# EAGLE design GERI_Gadget (EAGLE 9.1.0)
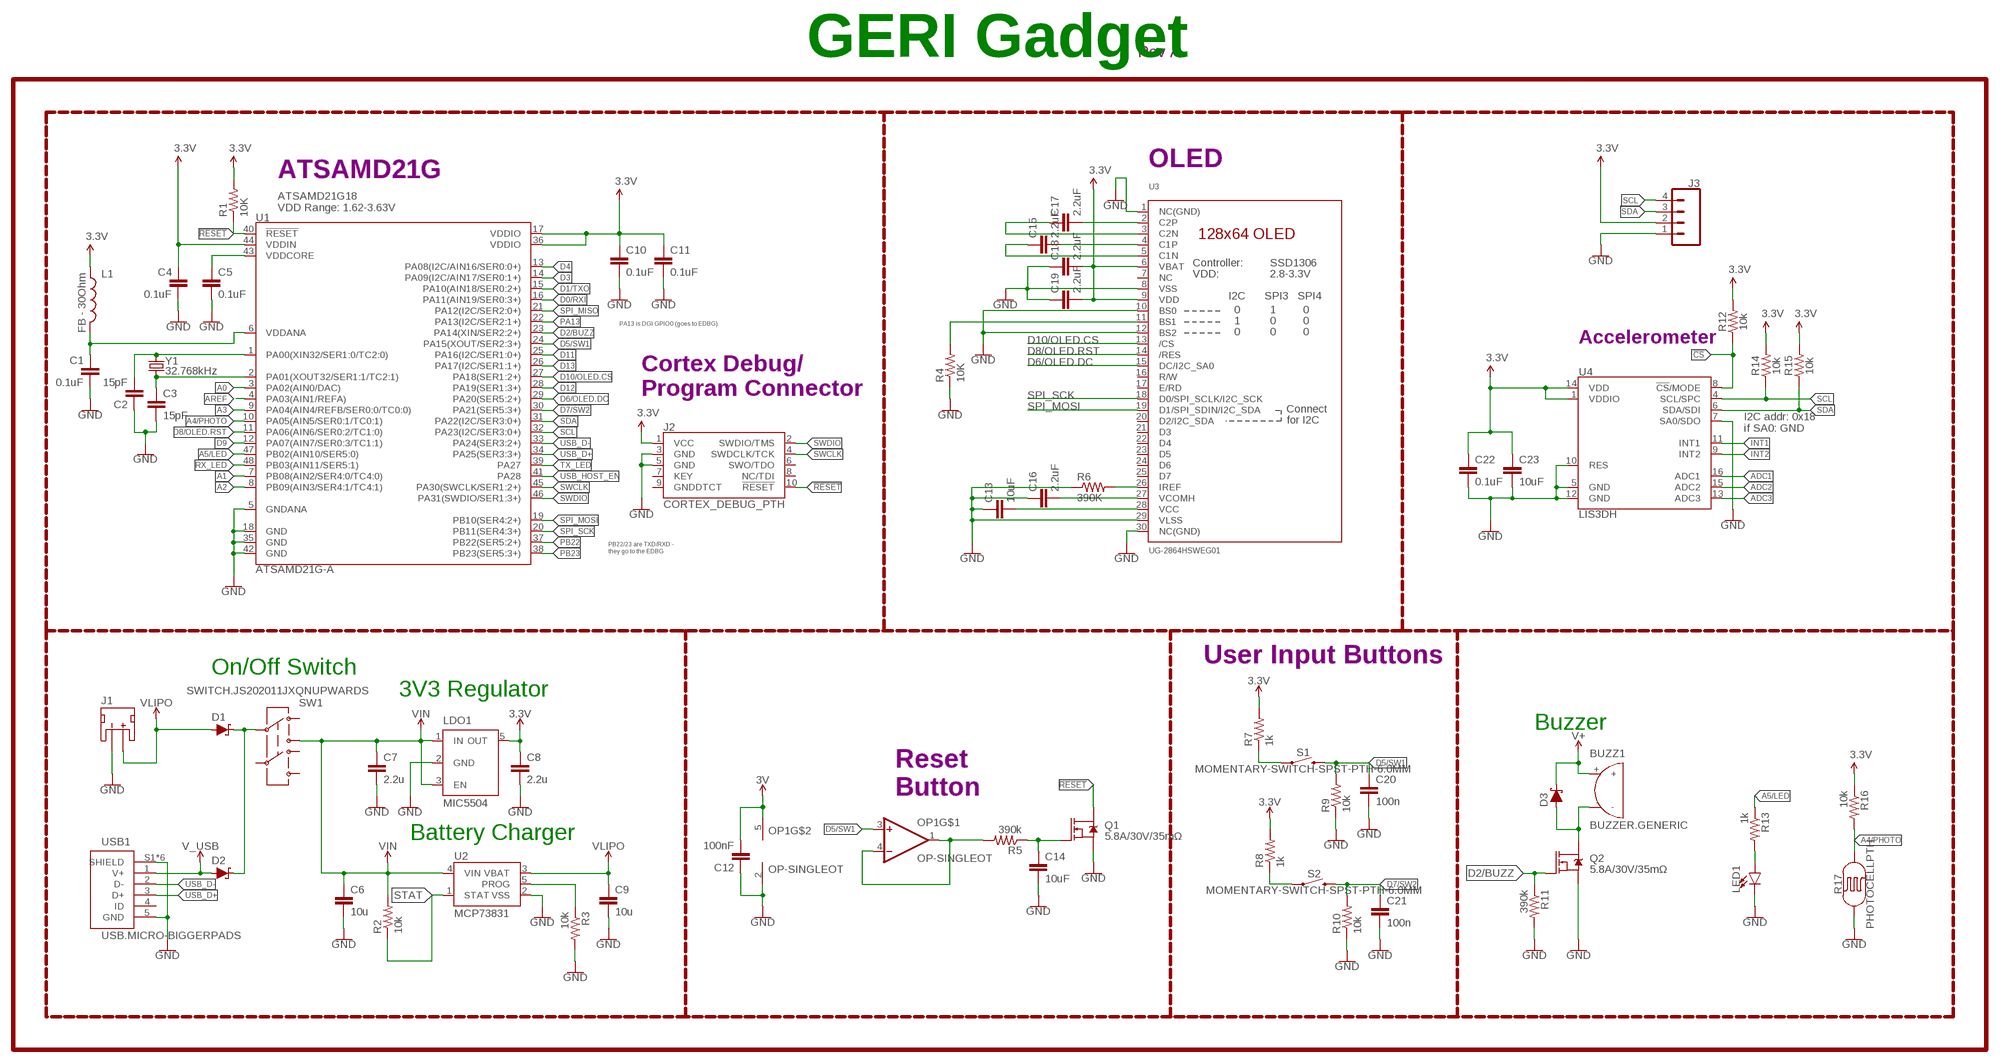
[diagram p0: schematic, sheet 1]

## Parts
BUZZ1  BUZZER.GENERIC  [PIEZO-1]
C1  0.1uF  CAPACITOR0402  [C0402]
C2  15pF  CAPACITOR0402  [C0402]
C3  15pF  CAPACITOR0402  [C0402]
C4  0.1uF  CAPACITOR0402  [C0402]
C5  0.1uF  CAPACITOR0402  [C0402]
C6  10u  CAPACITOR0603  [C0603]
C7  2.2u  CAPACITOR0603  [C0603]
C8  2.2u  CAPACITOR0603  [C0603]
C9  10u  CAPACITOR0603  [C0603]
C10  0.1uF  CAPACITOR0402  [C0402]
C11  0.1uF  CAPACITOR0402  [C0402]
C12  100nF  CAPACITOR0402  [C0402]
C13  10uF  CAPACITOR0603  [C0603]
C14  10uF  CAPACITOR0603  [C0603]
C15  2.2uF  CAPACITOR0603  [C0603]
C16  2.2uF  CAPACITOR0603  [C0603]
C17  2.2uF  CAPACITOR0603  [C0603]
C18  2.2uF  CAPACITOR0603  [C0603]
C19  2.2uF  CAPACITOR0603  [C0603]
C20  100n  CAPACITOR0402  [C0402]
C21  100n  CAPACITOR0402  [C0402]
C22  0.1uF  0.1UF-0402-16V-10%  [0402]
C23  10uF  10UF-0603-6.3V-20%  [0603]
D1  SCHOTTKY-USC  [USC]
D2  SCHOTTKY-USC  [USC]
D3  SCHOTTKY-USC  [USC]
J1  JST_2MM_MALE  [JST-2-SMD]
J2  CORTEX_DEBUG_PTH  [2X5-PTH-1.27MM]
J3  CONN_04  [1X04]
L1  FB - 30Ohm  INDUCTOR0603  [0603]
LDO1  MIC5504  [SOT23-5]
LED1  LED5MM  [LED_5MM]
OP1  OP-SINGLEOT  [SOT23-5]
Q1  5.8A/30V/35mΩ  NFET-AO3404A  [SOT23-3]
Q2  5.8A/30V/35mΩ  NFET-AO3404A  [SOT23-3]
R1  10K  RESISTOR0402-BIGGER  [R0402-BIGGER]
R2  10k  RESISTOR0402-BIGGER  [R0402-BIGGER]
R3  10k  RESISTOR0402-BIGGER  [R0402-BIGGER]
R4  10K  RESISTOR0402-BIGGER  [R0402-BIGGER]
R5  390k  RESISTOR0402-BIGGER  [R0402-BIGGER]
R6  390K  RESISTOR0402-BIGGER  [R0402-BIGGER]
R7  1k  RESISTOR0402-BIGGER  [R0402-BIGGER]
R8  1k  RESISTOR0402-BIGGER  [R0402-BIGGER]
R9  10k  RESISTOR0402-BIGGER  [R0402-BIGGER]
R10  10k  RESISTOR0402-BIGGER  [R0402-BIGGER]
R11  390k  RESISTOR0402-BIGGER  [R0402-BIGGER]
R12  10k  RESISTOR0402  [0402]
R13  1k  RESISTOR0402-BIGGER  [R0402-BIGGER]
R14  10k  RESISTOR0402  [0402]
R15  10k  RESISTOR0402  [0402]
R16  10k  RESISTOR0402-BIGGER  [R0402-BIGGER]
R17  PHOTOCELLPTH  [PHOTOCELL]
REV1  REVISION.A  [REV.A]
S1  MOMENTARY-SWITCH-SPST-PTH-6.0MM  [TACTILE_SWITCH_PTH_6.0MM]
S2  MOMENTARY-SWITCH-SPST-PTH-6.0MM  [TACTILE_SWITCH_PTH_6.0MM]
SW1  SWITCH.JS202011JXQNUPWARDS  [SWITCH.00]
U1  ATSAMD21G-A  [TQFP-48]
U2  MCP73831  [SOT23-5]
U3  UG-2864HSWEG01  DISP_OLED_UG-2864HSWEG01-NO-WRAPAROUND  [UG-2864HSWEG01_0.96IN_NO-WRAPAROUND]
U4  LIS3DH  [LGA-16-3X3]
USB1  USB.MICRO-BIGGERPADS  [USB-MICRO-01.BIGGERPADS]
Y1  32.768kHz  CRYSTAL3.2X1.5MM  [CRYSTAL-SMD-3.2X1.5MM]

## Nets
3.3V: C4.1 C8.1 C10.1 C11.1 C18.2 C19.2 C22.1 C23.1 J2.1(VCC) J3.2 L1.1 LDO1.5(OUT) R1.2 R7.2 R8.2 R12.2 R14.2 R15.2 R16.1 U1.17(VDDIO) U1.36(VDDIO) U1.44(VDDIN) U3.6(VBAT) U3.9(VDD) U4.1(VDDIO) U4.14(VDD)
3V: C12.2 OP1.5(V+)
!CS: R12.1 U4.8(!CS!/MODE)
!RESET: J2.10(!RESET) Q1.3(D) R1.1 U1.40(!RESET!)
A0: U1.3(PA02(AIN0/DAC))
A1: U1.7(PB08(AIN2/SER4:0/TC4:0))
A2: U1.8(PB09(AIN3/SER4:1/TC4:1))
A3: U1.9(PA04(AIN4/REFB/SER0:0/TC0:0))
A4/PHOTO: R16.2 R17.2 U1.10(PA05(AIN5/SER0:1/TC0:1))
A5/LED: R13.1 U1.47(PB02(AIN10/SER5:0))
ADC1: U4.16(ADC1)
ADC2: U4.15(ADC2)
ADC3: U4.13(ADC3)
AREF: U1.4(PA03(AIN1/REFA))
D0/RXI: U1.16(PA11(AIN19/SER0:3+))
D1/TXO: U1.15(PA10(AIN18/SER0:2+))
D2/BUZZ: Q2.1(G) R11.1 U1.23(PA14(XIN/SER2:2+))
D3: U1.14(PA09(I2C/AIN17/SER0:1+))
D4: U1.13(PA08(I2C/AIN16/SER0:0+))
D5/SW1: C20.1 OP1.3(+IN) R9.2 S1.3 U1.24(PA15(XOUT/SER2:3+))
D6/OLED.DC: U1.29(PA20(SER5:2+)) U3.15(DC/I2C_SA0)
D7/SW2: C21.1 R10.2 S2.3 U1.30(PA21(SER5:3+))
D8/OLED.RST: U1.11(PA06(AIN6/SER0:2/TC1:0)) U3.14(/RES)
D9: U1.12(PA07(AIN7/SER0:3/TC1:1))
D10/OLED.CS: U1.27(PA18(SER1:2+)) U3.13(/CS)
D11: U1.25(PA16(I2C/SER1:0+))
D12: U1.28(PA19(SER1:3+))
D13: U1.26(PA17(I2C/SER1:1+))
GND: C1.2 C2.1 C3.2 C4.2 C5.2 C6.2 C7.2 C8.2 C9.2 C10.2 C11.2 C12.1 C13.1 C14.2 C16.1 C18.1 C19.1 C20.2 C21.2 C22.2 C23.2 J1.1(-) J2.3(GND) J2.5(GND) J3.1 LDO1.2(GND) LED1.K(C) OP1.2(V-) Q1.2(S) Q2.2(S) R3.2 R4.1 R6.1 R9.1 R10.1 R11.2 R17.1 U1.5(GNDANA) U1.18(GND) U1.35(GND) U1.42(GND) U2.2(VSS) U3.1(NC(GND)) U3.8(VSS) U3.10(BS0) U3.12(BS2) U3.29(VLSS) U3.30(NC(GND)) U4.5(GND) U4.7(SA0/SDO) U4.10(RES) U4.12(GND) USB1.5(GND) USB1.S1(SHIELD) USB1.S2(SHIELD) USB1.S3(SHIELD) USB1.S4(SHIELD) USB1.S5(SHIELD) USB1.S6(SHIELD)
INT1: U4.11(INT1)
INT2: U4.9(INT2)
N$2: C2.2 U1.1(PA00(XIN32/SER1:0/TC2:0)) Y1.P$2
N$3: LED1.A R13.2
N$4: C3.1 U1.2(PA01(XOUT32/SER1:1/TC2:1)) Y1.P$1
N$7: OP1.1(OUT) OP1.4(-IN) R5.2
N$8: R7.1 S1.1
N$12: R8.1 S2.1
N$14: R3.1 U2.5(PROG)
N$16: D1.-(C) D2.-(C) SW1.2
N$17: C14.1 Q1.1(G) R5.1
N$22: R4.2 U3.11(BS1)
N$23: BUZZ1.- D3.+(A) Q2.3(D)
N$24: R6.2 U3.26(IREF)
N$25: C17.2 U3.2(C2P)
N$26: C17.1 U3.3(C2N)
N$27: C15.2 U3.4(C1P)
N$38: C15.1 U3.5(C1N)
N$39: C13.2 U3.28(VCC)
N$47: C16.2 U3.27(VCOMH)
PA13: U1.22(PA13(I2C/SER2:1+))
PB22: U1.37(PB22(SER5:2+))
PB23: U1.38(PB23(SER5:3+))
RX_LED: U1.48(PB03(AIN11/SER5:1))
SCL: J3.4 R14.1 U1.32(PA23(I2C/SER3:0+)) U4.4(SCL/SPC)
SDA: J3.3 R15.1 U1.31(PA22(I2C/SER3:0+)) U4.6(SDA/SDI)
SPI_MISO: U1.21(PA12(I2C/SER2:0+))
SPI_MOSI: U1.19(PB10(SER4:2+)) U3.19(D1/SPI_SDIN/I2C_SDA)
SPI_SCK: U1.20(PB11(SER4:3+)) U3.18(D0/SPI_SCLK/I2C_SCK)
STAT: R2.1 U2.1(STAT)
SWCLK: J2.4(SWDCLK/TCK) U1.45(PA30(SWCLK/SER1:2+))
SWDIO: J2.2(SWDIO/TMS) U1.46(PA31(SWDIO/SER1:3+))
TX_LED: U1.39(PA27)
USB_D+: U1.34(PA25(SER3:3+)) USB1.3(D+)
USB_D-: U1.33(PA24(SER3:2+)) USB1.2(D-)
USB_HOST_EN: U1.41(PA28)
V+: BUZZ1.+ D3.-(C)
V_USB: D2.+(A) USB1.1(V+)
VDDANA: C1.1 L1.2 U1.6(VDDANA)
VDDCORE: C5.1 U1.43(VDDCORE)
VIN: C6.1 C7.1 LDO1.1(IN) LDO1.3(EN) R2.2 SW1.3 U2.4(VIN)
VLIPO: C9.1 D1.+(A) J1.2(+) U2.3(VBAT)
Unconnected: J1.NC1(PAD1) J1.NC2(PAD2) J2.6(SWO/TDO) J2.7(KEY) J2.8(NC/TDI) J2.9(GNDDTCT) SW1.1 SW1.5 SW1.6 SW1.7 U3.7(NC) U3.16(R/W) U3.17(E/RD) U3.20(D2/I2C_SDA) U3.21(D3) U3.22(D4) U3.23(D5) U3.24(D6) U3.25(D7) USB1.4(ID)

## Notes on the sheet
- GERI Gadget
- OLED
- ATSAMD21G
- ATSAMD21G18
  VDD Range: 1.62-3.63V
- PA13 is DGI GPIO0 (goes to EDBG).
- Accelerometer
- Cortex Debug/
  Program Connector
- I2C addr: 0x18
  if SA0: GND
- PB22/23 are TXD/RXD - 
  they go to the EDBG
- User Input Buttons
- On/Off Switch
- 3V3 Regulator
- Buzzer
- Reset
  Button
- Battery Charger

## Library data of the parts
BUZZ1 = CalvEngIO-Electromechanical:BUZZER.GENERIC
C1-C21 = CalvEngIO-Passives:CAPACITOR
C22 = SparkFun-Capacitors:0.1UF: 0.1µF ceramic capacitors A capacitor is a passive two-terminal electrical component used to store electrical energy temporarily in an electric field.; PROD_ID: CAP-12416
C23 = SparkFun-Capacitors:10UF: 10.0µF ceramic capacitors A capacitor is a passive two-terminal electrical component used to store electrical energy temporarily in an electric field.; PROD_ID: CAP-11015
D1-D3 = CalvEngIO-DiscreteSemi:SCHOTTKY: Schottky diode A Schottky diode is a semiconductor diode which has a low forward voltage drop and a very fast switching action. Example: Digi-Key Part Number: RB161MM-20CT-ND
J1 = CalvEngIO-Connectors:JST_2MM_MALE: JST 2MM MALE RA CONNECTOR Two pin, compact surface mount connector. Commonly used as a battery input connection point. We really like the solid locking feeling and high current rating on these small connectors. We use these all the time as battery connectors. Mates to single-cell LiPo batteries. Here is the connector we sell at SparkFun: JST Right Angle Connector - White <https://www.sparkfun.com/products/8612> (PRT-08612) Datasheet <http://www.sparkfun.com/datasheets/Prototyping/Connectors/JST-Horizontal.pdf> It was used on these SparkFun products: SparkFun MOSFET Power Controller <https://www.sparkfun.com/products/11214> (PRT-11214) SparkFun Battery Babysitter - LiPo Battery Manager <https://www.sparkfun.com/products/13777> (PRT-13777) And many, many others that required a lipo battery connection.; PROD_ID: CONN-11443; SF_ID: PRT-08612
J2 = CalvEngIO-Connectors:CORTEX_DEBUG: Cortex Debug Connector - 10 pin Supports JTAG debug, Serial Wire debug, and Serial Wire Viewer. PTH and SMD connector options available. General Connector Information <http://infocenter.arm.com/help/topic/com.arm.doc.faqs/attached/13634/cortex_debug_connectors.pdf> Products: PTH Connector <http://www.digikey.com/product-detail/en/cnc-tech/3220-10-0100-00/1175-1627-ND/3883661> -via Digi-Key SparkFun PSoc <https://www.sparkfun.com/products/13229> SparkFun T <https://www.sparkfun.com/products/13810>
J3 = CalvEngIO-Connectors:CONN_04: Multi connection point. Often used as Generic Header-pin footprint for 0.1 inch spaced/style header connections On any of the 0.1 inch spaced packages, you can populate with these: Break Away Headers - Straight <https://www.sparkfun.com/products/116> (PRT-00116) Break Away Male Headers - Right Angle <https://www.sparkfun.com/products/553> (PRT-00553) Female Headers <https://www.sparkfun.com/products/115> (PRT-00115) Break Away Headers - Machine Pin <https://www.sparkfun.com/products/117> (PRT-00117) Break Away Female Headers - Swiss Machine Pin <https://www.sparkfun.com/products/743> (PRT-00743) For SCREWTERMINALS and SPRING TERMINALS visit here: Screw Terimnals on SparkFun.com <https://www.sparkfun.com/search/results?term=Screw+Terminals> (5mm/3.5mm/2.54mm spacing) This device is also useful as a general connection point to wire up your design to another part of your project. Our various solder wires solder well into these plated through hole pads. Hook-Up Wire - Assortment (Stranded, 22 AWG) <https://www.sparkfun.com/products/11375> (PRT-11375) Hook-Up Wire - Assortment (Solid Core, 22 AWG) <https://www.sparkfun.com/products/11367> (PRT-11367) View the entire wire category on our website here <https://www.sparkfun.com/categories/141> Special notes: Molex polarized connector foot print use with SKU : PRT-08231 with associated crimp pins and housings. 1MM SMD Version SKU: PRT-10208; PROD_ID: CONN-09696
L1 = SparkFun-Passives:INDUCTOR: Inductors Basic Inductor/Choke - 0603 and 1206. Footprints are not proven and vary greatly between part numbers. INDUCTOR POWER 3.3UH 4.0A SMD 0.197" L x 0.197" W x 0.177" H (5.00mm x 5.00mm x 4.50mm); PROD_ID: RES-07859
LDO1 = CalvEngIO-Power:MIC5504: MIC5504 Voltage Regulator Output Voltages: 1.0V to 3.3V Input Voltages: 2.5V to 5.5V Link to Datasheet http://ww1.microchip.com/downloads/en/DeviceDoc/MIC550X.pdf
LED1 = CalvEngIO-LED:LED: LED (Generic) Standard schematic elements and footprints for 5mm, 3mm, 1206, and 0603 sized LEDs. Generic LEDs with no color specified. LTST-C190KGKT: arrow indicates cathode
OP1 = CalvEngIO-AnalogIC:OP-SINGLE: Single Op Amp 2.7V to 6.0V Single Supply CMOS Source: http://ww1.microchip.com/downloads/en/DeviceDoc/21314g.pdf
Q1 Q2 = CalvEngIO-DiscreteSemi:NFET: N-channel MOSFETs Voltage controlled devices that allow control of high current outputs. SparkFun Products: SparkFun OpenScale <https://www.sparkfun.com/products/13261> SparkFun Digital Sandbox <https://www.sparkfun.com/products/12651> SparkFun Monster Moto Shield <https://www.sparkfun.com/products/10182> SparkFun MOSFET Power Controller <https://www.sparkfun.com/products/11214>; PROD_ID: TRANS-12988
R1-R11 R13 R16 = CalvEngIO-Passives:RESISTOR
R12 R14 R15 = SparkFun-Resistors:RESISTOR: Generic Resistor Package
R17 = CalvEngIO-Sensors:PHOTOCELL: Photocell (Photodetector, Photo Resistor, CdS) This is a very small light sensor. A photocell changes (also called a photodetector, photo resistor, CdS or photoconductive cell) resistance depending on the amount of light it is exposed to. These little sensors make great ambient light triggers (when light in the room turns on, do something). Datasheet <http://cdn.sparkfun.com/datasheets/Sensors/LightImaging/SEN-09088.pdf> SparkFun Products Mini Photocell <https://www.sparkfun.com/products/9088> (SEN-09088); PROD_ID: COMP-09129; SF_ID: SEN-09088
REV1 = CalvEngIO-Logos:REVISION.A
S1 S2 = SparkFun-Switches:MOMENTARY-SWITCH-SPST: Momentary Switch (Pushbutton) - SPST Normally-open (NO) SPST momentary switches (buttons, pushbuttons). Variants PTH-12MM - 12mm square, through-hole Momentary Pushbutton Switch - 12mm Square <https://www.sparkfun.com/products/9190> (COM-09190) PTH-6.0MM, PTH-6.0MM-KIT - 6.0mm square, through-hole Mini Pushbutton Switch <https://www.sparkfun.com/products/97> (COM-00097) KIT package intended for soldering kit's - only one side of pads' copper is exposed. PTH-RIGHT-ANGLE-KIT - Right-angle, through-hole Right Angle Tactile Button <https://www.sparkfun.com/products/10791> - Used on SparkFun BigTime Watch Kit <https://www.sparkfun.com/products/11734> SMD-12MM - 12mm square, surface-mount Tactile Button - SMD (12mm) <https://www.sparkfun.com/products/12993> (COM-12993) Used on SparkFun PicoBoard <https://www.sparkfun.com/products/11888> SMD-4.5MM - 4.5mm Square Trackball Switch Used on SparkFun Blackberry Trackballer Breakout <https://www.sparkfun.com/products/13169> SMD-4.6MMX2.8MM - 4.60mm x 2.80mm, surface mount Used on SparkFun SAMD21 Mini Breakout <https://www.sparkfun.com/products/13664> SMD-5.2MM, SMD-5.2-REDUNDANT - 5.2mm square, surface-mount Mini Pushbutton Switch - SMD <https://www.sparkfun.com/products/8720> (COM-08720) Used on Arduino Pro Mini <https://www.sparkfun.com/products/11114> REDUNDANT package connects both switch circuits together SMD-6.0X3.5MM - 6.0 x 3.5mm, surface mount Momentary Reset Switch SMD <https://www.sparkfun.com/products/8229> (COM-08229) SMD-6.2MM-TALL - 6.2mm square, surface mount Tactile Button - SMD (6mm) <https://www.sparkfun.com/products/12992> Used on SparkFun Digital Sandbox <https://www.sparkfun.com/products/12651> SMD-RIGHT-ANGLE - Right-angle, surface mount Used on SparkFun Block for Intel® Edison - Arduino <https://www.sparkfun.com/products/13036>; PROD_ID: SWCH-08441; SF_SKU: COM-00097
SW1 = CalvEngIO-Switches:SWITCH.JS202011JXQN: Manufacturer's Part Numer: JS202011JAQN for right angle throw JS202011JCQN for top side throw
U1 = CalvEngIO-Microcontrollers:ATSAMD21G: Atmel SAMD21G SMART ARM-Based Microcontroller The Atmel ® | SMART ™ SAM D21 is a series of low-power microcontrollers using the 32-bit ARM ® Cortex ® -M0+ processor, and ranging from 32- to 64-pins with up to 256KB Flash and 32KB of SRAM. The SAM D21 devices operate at a maximum frequency of 48MHz and reach 2.46 CoreMark/MHz. They are designed for simple and intuitive migration with identical peripheral modules, hex compatible code, identical linear address map and pin compatible migration paths between all devices in the product series. All devices include intelligent and flexible peripherals, Atmel Event System for inter-peripheral signaling, and support for capacitive touch button, slider and wheel user interfaces. Datasheet <https://cdn.sparkfun.com/datasheets/Dev/Arduino/Boards/Atmel-42181-SAM-D21_Datasheet.pdf> SparkFun Products SparkFun SAMD21 Mini Breakout <https://www.sparkfun.com/products/13664> (DEV-13664) SparkFun SAMD21 Dev Breakout <https://www.sparkfun.com/products/13672> (DEV-13672); PROD_ID: IC-13064
U2 = CalvEngIO-Power:MCP73831: MCP73831T Li-Ion, Li-Pol Controller Miniature single cell, fully integrated Li-Ion, Li-polymer charge management controller Datasheet <http://ww1.microchip.com/downloads/en/DeviceDoc/20001984g.pdf> SparkFun Products: SparkFun ESP32 Thing <https://www.sparkfun.com/products/13907> SparkFun 9DoF Razor IMU M0 <https://www.sparkfun.com/products/14001>; PROD_ID: IC-09995
U3 = CalvEngIO-Displays:DISP_OLED_UG-2864HSWEG01: UG-2864HSWEG01 OLED display Both 1.3" and 0.96" models share the same FPC tab footprint, only the screen dimensions vary.
U4 = SparkFun-Sensors:LIS3DH: ST Microelectronics LIS3DH 3-Axis ±2/4/8/16g SPI/I2C Accelerometer The LIS3DH is a three axis MEMS linear accelerometer in the "nano" family. It has a digital I2C/SPI serial interface which makes it ideal for using in embedded applications. The device also features ultra low-power operational modes that allow advanced power saving and smart sleep to wake-up functions, built in detections with interrupts, and auxiliary ADC inputs Datasheet-XXXX <http://www.sparkfun.com/datasheets/Sensors/Accelerometer/LIS3DH.pdf> SparkFun Products SparkFun Triple Axis Accelerometer Breakout - LIS3DH <https://www.sparkfun.com/products/10345> (SEN-XXXXX) Triple Axis Accelerometer - LIS3DH <https://www.sparkfun.com/products/9755> (SEN-XXXXX); PROD_ID: IC-13419; SF_ID: N/A
USB1 = CalvEngIO-Connectors:USB.MICRO: DigiKey PN: 609-4613-1-ND
Y1 = samd21-temp:CRYSTAL: Various standard crystals. Proven footprints.; PROD_ID: XTAL-13062

## Board
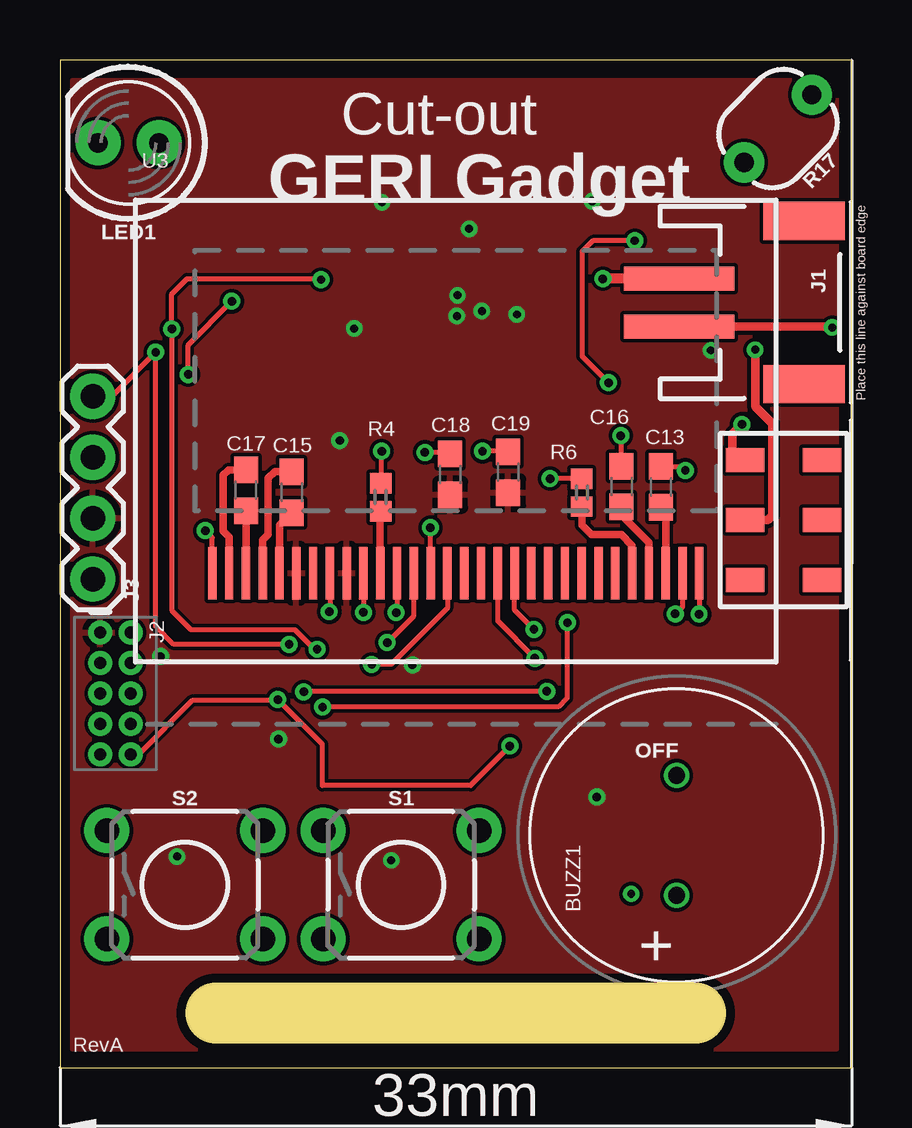
[diagram p1: board, top side]
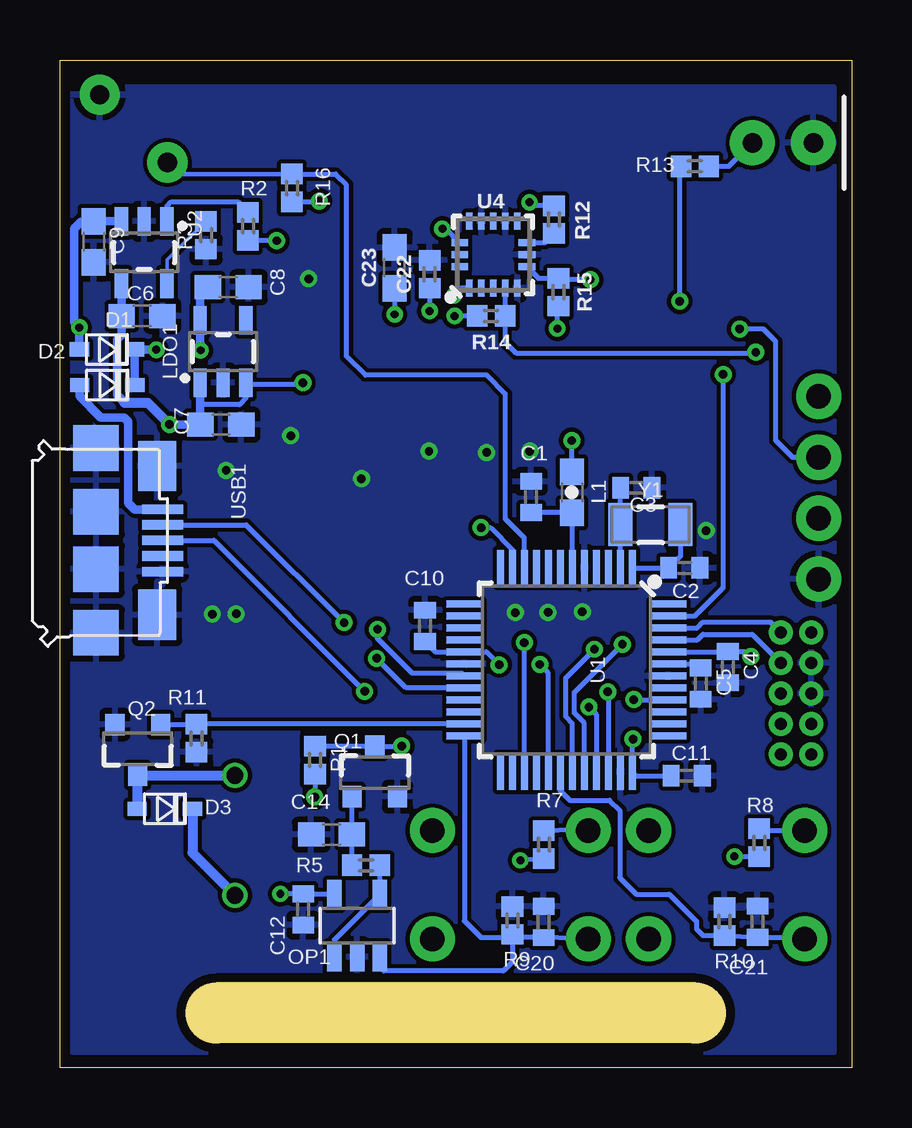
[diagram p2: board, bottom side, seen from below]

Size 33 x 42 mm. Coordinates in mm from the lower left corner, seen from the top.
Outline: 6.5,2.27 26.5,2.27
Outline: 0,0 33,0 33,42 0,42 0,0
Copper layers (1*16): Top 0.0356mm / dielectric 1.5011mm / Bottom 0.0356mm
Design rules "LaenPCBOrder": minimum track width 6mil, minimum drill 13mil, track to track 6mil, track to pad 6mil, pad to pad 6mil, via to via 6mil, smd to smd 6mil, copper to edge 15mil, drill to drill 6mil, minimum pad ring 7mil, minimum via ring 7mil, stop-mask expansion 3mil, vias tented up to drill 0mil, thermal gap 10mil

### Footprints (pad centres in the part's own frame; a part is rotated, then mirrored left to right if it is on the bottom)
PIEZO-1 = drill 0.7: + -2.5,0; - 2.5,0
C0402 = smd 0.7 x 0.9: 1 -0.65,0; 2 0.65,0
C0603 = smd 1.1 x 1: 1 -0.85,0; 2 0.85,0
0402 = smd 0.85 x 0.9: 1 -0.58,0; 2 0.58,0
0603 = smd 1.1 x 1: 1 -0.85,0; 2 0.85,0
USC = smd 0.8 x 0.6: + -1.15,0; - 1.15,0
JST-2-SMD = smd 1 x 4.6: 1 -1,-3.7; 2 1,-3.7 | smd 1.6 x 3.4: NC1 -3.4,1.5; NC2 3.4,1.5
2X5-PTH-1.27MM = drill 0.508 pad 1: 1 -2.54,-0.635; 2 -2.54,0.635; 3 -1.27,-0.635; 4 -1.27,0.635; 5 0,-0.635; 6 0,0.635; 7 1.27,-0.635; 8 1.27,0.635; 9 2.54,-0.635; 10 2.54,0.635
1X04 = drill 1.016 pad 1.88: 1 0,0; 2 2.54,0; 3 5.08,0; 4 7.62,0
SOT23-5 = smd 0.55 x 1.2: 1 -0.95,-1.3; 2 0,-1.3; 3 0.95,-1.3; 4 0.95,1.3; 5 -0.95,1.3
LED_5MM = drill 0.813 pad 1.88: A -1.27,0; K 1.27,0
SOT23-5' = smd 0.6 x 1.2: 1 -0.95,-1.306; 2 0,-1.306; 3 0.95,-1.306; 4 0.95,1.306; 5 -0.95,1.306
SOT23-3 = smd 0.8 x 0.9: 1 -0.95,-1; 2 0.95,-1; 3 0,1.1
R0402-BIGGER = smd 0.85 x 0.9: 1 -0.58,0; 2 0.58,0
PHOTOCELL = drill 0.8 pad 1.676: 1 -2,0; 2 2,0
TACTILE_SWITCH_PTH_6.0MM = drill 1.016 pad 1.88: 1 -3.251,2.261; 2 3.251,2.261; 3 -3.251,-2.261; 4 3.251,-2.261
SWITCH.00 = smd 1 x 1.6: 1 -2.5,1.6; 2 0,1.6; 3 2.5,1.6; 5 -2.5,-1.6; 6 0,-1.6; 7 2.5,-1.6
TQFP-48 = smd 1.5 x 0.28: 1 -4.25,2.75; 2 -4.25,2.25; 3 -4.25,1.75; 4 -4.25,1.25; 5 -4.25,0.75; 6 -4.25,0.25; 7 -4.25,-0.25; 8 -4.25,-0.75; 9 -4.25,-1.25; 10 -4.25,-1.75; 11 -4.25,-2.25; 12 -4.25,-2.75; 25 4.25,-2.75; 26 4.25,-2.25; 27 4.25,-1.75; 28 4.25,-1.25; 29 4.25,-0.75; 30 4.25,-0.25; 31 4.25,0.25; 32 4.25,0.75; 33 4.25,1.25; 34 4.25,1.75; 35 4.25,2.25; 36 4.25,2.75 | smd 0.28 x 1.5: 13 -2.75,-4.25; 14 -2.25,-4.25; 15 -1.75,-4.25; 16 -1.25,-4.25; 17 -0.75,-4.25; 18 -0.25,-4.25; 19 0.25,-4.25; 20 0.75,-4.25; 21 1.25,-4.25; 22 1.75,-4.25; 23 2.25,-4.25; 24 2.75,-4.25; 37 2.75,4.25; 38 2.25,4.25; 39 1.75,4.25; 40 1.25,4.25; 41 0.75,4.25; 42 0.25,4.25; 43 -0.25,4.25; 44 -0.75,4.25; 45 -1.25,4.25; 46 -1.75,4.25; 47 -2.25,4.25; 48 -2.75,4.25
UG-2864HSWEG01_0.96IN_NO-WRAPAROUND = smd 0.35 x 2.2: 1 -10.15,-1.2; 2 -9.45,-1.2; 3 -8.75,-1.2; 4 -8.05,-1.2; 5 -7.35,-1.2; 6 -6.65,-1.2; 7 -5.95,-1.2; 8 -5.25,-1.2; 9 -4.55,-1.2; 10 -3.85,-1.2; 11 -3.15,-1.2; 12 -2.45,-1.2; 13 -1.75,-1.2; 14 -1.05,-1.2; 15 -0.35,-1.2; 16 0.35,-1.2; 17 1.05,-1.2; 18 1.75,-1.2; 19 2.45,-1.2; 20 3.15,-1.2; 21 3.85,-1.2; 22 4.55,-1.2; 23 5.25,-1.2; 24 5.95,-1.2; 25 6.65,-1.2; 26 7.35,-1.2; 27 8.05,-1.2; 28 8.75,-1.2; 29 9.45,-1.2; 30 10.15,-1.2
LGA-16-3X3 = smd 0.7 x 0.28: 1 -1.4,1; 2 -1.4,0.5; 3 -1.4,0; 4 -1.4,-0.5; 5 -1.4,-1; 9 1.4,-1; 10 1.4,-0.5; 11 1.4,0; 12 1.4,0.5; 13 1.4,1 | smd 0.28 x 0.7: 6 -0.5,-1.4; 7 0,-1.4; 8 0.5,-1.4; 14 0.5,1.4; 15 0,1.4; 16 -0.5,1.4
USB-MICRO-01.BIGGERPADS = smd 0.4 x 1.7: 1 -1.3,1.505; 2 -0.65,1.505; 3 0,1.505; 4 0.65,1.505; 5 1.3,1.505 | smd 1.9 x 1.9: S1 -3.85,-1.27; S2 -1.2,-1.27; S3 1.2,-1.27; S4 3.85,-1.27 | smd 2.1 x 1.6: S5 -3.1,1.28; S6 3.1,1.28
CRYSTAL-SMD-3.2X1.5MM = smd 1 x 1.8: P$1 -1.25,0; P$2 1.25,0

### Placement (x,y rotation side)
BUZZ1  25.7,9.68 90 top
C1  13.36,23.79 90 bottom
C2  6.97,20.83 180 bottom
C3  8.98,24.17 0 bottom
C4  5.16,16.69 270 bottom
C5  6.29,16 270 bottom
C6  29.58,31.33 0 bottom
C7  26.29,26.8 0 bottom
C8  25.98,32.52 0 bottom
C9  31.58,34.42 270 bottom
C10  17.78,18.41 90 bottom
C11  6.87,12.17 0 bottom
C12  22.86,6.59 90 bottom
C13  25.04,24.21 270 top
C14  21.68,9.72 180 bottom
C15  9.66,23.98 90 top
C16  23.41,24.22 270 top
C17  7.76,24.07 90 top
C18  16.27,24.73 270 top
C19  18.68,24.82 270 top
C20  12.84,6.07 90 bottom
C21  3.92,6.08 90 bottom
C22  17.59,33.07 90 bottom
C23  19.05,33.34 90 bottom
D1  31.04,29.93 0 bottom
D2  31.03,28.45 0 bottom
D3  28.63,10.78 0 bottom
J1  29.51,31.89 270 top
J2  2.31,15.6 270 top
J3  1.37,20.36 90 top
L1  11.66,23.98 270 bottom
LDO1  26.2,29.84 0 bottom
LED1  2.86,38.54 180 top
OP1  OP-SINGLEOT  [SOT23-5']  20.61,5.92 0 bottom
Q1  19.88,12.29 0 bottom
Q2  29.76,13.3 180 bottom
R1  22.36,12.81 270 bottom
R2  25.16,35.06 270 bottom
R3  26.91,34.7 270 bottom
R4  13.37,23.77 270 top
R5  20.24,8.43 0 bottom
R6  21.76,23.96 270 top
R7  12.83,9.3 270 bottom
R8  3.85,9.37 270 bottom
R9  14.14,6.13 270 bottom
R10  5.3,6.08 270 bottom
R11  27.3,13.73 270 bottom
R12  12.41,35.34 90 bottom
R13  6.53,37.57 0 bottom
R14  15.02,31.33 180 bottom
R15  12.22,32.32 270 bottom
R16  23.33,36.66 90 bottom
R17  29.93,39.14 225 top
REV1  0.55,0.65 0 top
S1  14.22,7.62 0 top
S2  5.21,7.62 0 top
SW1  30.16,22.82 90 top
U1  11.89,16.57 270 bottom
U2  29.49,33.97 180 bottom
U3  16.5,21.81 0 top
U4  14.94,33.88 90 bottom
USB1  30.23,21.97 270 bottom
Y1  8.38,22.63 0 bottom

### Tracks (layer width: path | path; a pad name or v marks a point on that pad's centre or on a via)
3.3V  (via drill 0.33, 0.35)
  Bottom 0.203: U1.44 5.17,17.32 C4.1 4.4,17.34 v4.19,17.13 | v13.8,8.64 v13.79,8.65 R7.2 | C23.1 v19.05,31.39 | C22.1 v17.59,31.53 | U4.1 16.28,32.48 v16.57,32.19 | R15.2 12.27,31.69 v12.27,30.81 | R12.2 13.28,35.92 v13.43,36.07 | R14.2 v16.55,31.33 | U4.14 16.91,34.96 v17.06,34.96 | v4.88,8.8 4.83,8.77 4.46,8.79 R8.2 | v14.69,16.79 15.23,17.32 U1.17 16.15,17.33 17.35,17.33 C10.1 | L1.1 v11.66,26.14 | R1.2 22.36,11.29 v22.38,11.28 | v22.19,36.12 22.24,36.09 R16.1 | C11.1 8.98,12.17 U1.36 9.14,13.66 v9.11,13.69
  Bottom 0.356: v27.14,29.89 27.15,29.91 LDO1.5 27.15,32.21 C8.1
  pour Top: 0.58,41.15 32.38,41.15 32.38,0.76 0.51,0.76 0.51,41.15
3V  (via drill 0.33)
  Bottom 0.203: OP1.5 22.84,7.22 C12.2 v23.81,7.24
!CS
  Bottom 0.203: U4.8 12.79,34.38 R12.1
!RESET  (via drill 0.35)
  Top 0.152: J2.10 3.28,13.06 | 9.05,15.32 v9.08,15.34
  Top 0.203: 3.28,13.06 5.54,15.32 9.05,15.32 | v18.76,13.4 17.12,11.76 10.95,11.76 10.95,13.47 v9.08,15.34
  Bottom 0.152: v9.08,15.34 9.06,15.32
  Bottom 0.203: 9.06,15.32 U1.40 | R1.1 Q1.3 v18.76,13.39 v18.76,13.4
A4/PHOTO
  Bottom 0.203: R17.2 28.02,37.22 R16.2 21.51,37.24 21.06,36.79 21.06,29.64 20.27,28.85 15.2,28.85 14.43,28.08 14.43,22.87 13.64,22.08 U1.10
A5/LED  (via drill 0.35)
  Top 0.203: v5.35,28.89 5.35,30.12 v7.16,31.94
  Bottom 0.203: U1.47 6.53,18.82 5.35,20 v5.35,28.89 | v7.16,31.94 7.16,37.51 R13.1
D2/BUZZ
  Bottom 0.203: Q2.1 28.79,14.31 27.43,14.31 | 27.43,14.31 R11.1 | U1.23 27.42,14.32 27.43,14.31
D5/SW1
  Bottom 0.203: S1.3 C20.1 12.85,5.42 C20.1 14.12,5.42 | 14.12,5.42 R9.2 14.13,4.41 14.52,4.03 19.5,4.03 19.66,4.19 OP1.3 | U1.24 16.14,6.1 15.45,5.42 14.12,5.42
D6/OLED.DC  (via drill 0.35)
  Top 0.203: v12.99,16.8 13.8,16.8 16.15,19.15 U3.15
  Bottom 0.203: U1.29 12.64,16.45 v12.99,16.8
D7/SW2
  Bottom 0.203: S2.3 1.97,5.43 C21.1 R10.2 6.19,5.5 6.46,5.78 6.46,6.1 7.59,7.23 8.98,7.23 9.66,7.91 9.66,10.72 10.08,11.14 11.75,11.14 12.14,11.53 U1.30
D8/OLED.RST  (via drill 0.35)
  Top 0.203: U3.14 v15.45,22.5 v15.44,22.5
  Bottom 0.203: v15.44,22.5 15.06,22.5 14.13,21.58 U1.11
D10/OLED.CS  (via drill 0.35)
  Top 0.203: U3.13 14.75,18.83 13.69,17.77 v13.64,17.72
  Bottom 0.203: U1.27 v13.64,17.71 v13.64,17.72
GND  (via drill 0.35)
  Top 0.203: U3.29 25.95,19.21 v25.65,18.91 | U3.30 v26.65,18.9 v26.64,18.9 | R4.1 13.41,24.39 v13.41,25.69 | C18.1 16.2,25.64 v15.21,25.64 | C19.1 18.66,25.69 v17.61,25.69 | R6.1 v20.44,24.55 v20.43,24.55 | C16.1 23.41,26.31 v23.38,26.34 | C13.1 25.91,25.06 v26.07,24.89 | U3.8 11.25,19.02 v11.23,19 | U3.10 v12.65,18.98 v12.65,18.97 | U3.12 14.05,19 v14.02,18.96 | U3.1 6.35,22.09 v6.06,22.38
  Top 0.406: J1.1 v22.64,32.89 v22.63,32.88
  pour Bottom (isolate 0.178): 0.71,40.89 32.49,40.89 32.49,0.61 0.71,0.61
N$2
  Bottom 0.203: U1.1 C2.2 7.13,21.32 Y1.P$2
N$3
  Bottom 0.203: R13.2 5.11,37.57 LED1.A
N$4
  Bottom 0.203: U1.2 Y1.P$1 C3.1
N$7
  Bottom 0.203: R5.2 OP1.4 21.56,5.32 OP1.1
N$8
  Bottom 0.203: R7.1 10.97,9.95 S1.1
N$12
  Bottom 0.203: R8.1 3.78,9.88 S2.1
N$14
  Bottom 0.152: R3.1 27.42,34.77 27.46,34.77 28.54,33.69 U2.5
N$16  (via drill 0.33)
  Top 0.356: SW1.2 29.5,22.82 29.69,23.01 29.69,26.84 28.98,27.55 v28.98,29.92
  Bottom 0.356: v28.98,29.92 28.99,29.93 D1.- D2.-
N$17
  Bottom 0.203: R5.1 20.82,9.7 20.82,9.71 C14.1 Q1.1
N$22
  Top 0.305: U3.11 13.35,23.1 R4.2
N$23
  Bottom 0.406: BUZZ1.- 29.74,12.18 Q2.3 29.78,12.18 D3.+
N$24
  Top 0.305: U3.26 23.85,21.77 23.41,22.21 22.16,22.21 21.75,22.62 R6.2
N$25
  Top 0.305: U3.2 7.05,22.12 6.81,22.36 6.81,24.7 7.02,24.92 C17.2
N$26
  Top 0.305: U3.3 7.75,23.21 C17.1
N$27
  Top 0.305: U3.4 8.45,21.99 8.69,22.23 8.69,24.57 8.97,24.85 9.64,24.85 C15.2
N$38
  Top 0.305: U3.5 9.15,22.61 C15.1
N$39
  Top 0.305: U3.28 25.25,23.15 C13.2
N$47
  Top 0.305: U3.27 24.55,21.88 23.41,23.03 C16.2
SCL  (via drill 0.35)
  Top 0.203: v9.55,17.64 4.75,17.64 3.99,18.4 v3.99,29.82 2.15,27.98 J3.4
  Bottom 0.203: U4.4 R14.1 14.44,30.24 13.98,29.78 4.03,29.78 v3.99,29.82 | U1.32 11.14,14.36 11.55,14.77 11.55,15.64 v9.55,17.64
SDA  (via drill 0.35)
  Top 0.203: v10.72,17.44 10.61,17.44 9.8,18.25 5.46,18.25 4.69,19.02 4.69,30.81 v4.66,30.79 4.66,32.24 5.3,32.88 10.85,32.88 v10.88,32.84
  Bottom 0.203: U4.6 13.05,32.9 R15.1 12.16,32.84 v10.88,32.84 | U1.31 11.64,14.35 11.91,14.62 11.91,16.25 v10.72,17.44 | v4.66,30.79 3.68,30.79 3.16,30.26 3.16,26.14 2.46,25.44 J3.3
SPI_MOSI  (via drill 0.35)
  Top 0.203: v19.76,18.26 18.95,19.07 U3.19
  Bottom 0.203: U1.19 16.24,16.43 18.3,16.43 19.76,17.89 v19.76,18.26
SPI_SCK  (via drill 0.35)
  Top 0.203: v19.8,17.06 18.25,18.61 U3.18
  Bottom 0.203: U1.20 18.57,15.82 v19.8,17.06
STAT
  Bottom 0.203: U2.1 28.54,35.91 28.36,36.09 25.58,36.09 25.16,35.67 R2.1
SWCLK
  Bottom 0.203: U1.45 6.43,17.82 6.2,18.06 4.14,18.06 J2.4
SWDIO
  Bottom 0.203: U1.46 6.44,18.32 6.19,18.57 3.38,18.57 J2.2
USB_D+  (via drill 0.35)
  Top 0.203: v20.3,15.68 10.19,15.68 v10.16,15.66
  Bottom 0.203: USB1.3 26.58,21.97 v20.3,15.68 | v10.16,15.66 10.14,15.64 U1.34
USB_D-  (via drill 0.35)
  Top 0.203: v10.95,15.02 10.96,15.04 20.78,15.04 21.14,15.4 21.14,18.53 v21.16,18.55
  Bottom 0.203: USB1.2 25.23,22.62 v21.16,18.55 | v10.95,15.02 10.64,14.71 U1.33
V+
  Bottom 0.406: D3.- 27.48,8.95 BUZZ1.+
V_USB
  Bottom 0.356: D2.+ 32.18,27.98 31.29,27.1 30.33,27.1 30.16,26.94 30.16,23.53 29.9,23.27 USB1.1
VDDANA
  Bottom 0.203: C1.1 13.4,23.09 13.59,23.09 13.56,23.13 L1.2 11.64,23.11 U1.6
VDDCORE
  Bottom 0.203: U1.43 6.46,16.82 C5.1
VIN  (via drill 0.35)
  Top 0.203: v23.96,34.47 22.23,34.47 21.77,34.01 21.77,29.65 v22.87,28.55
  Top 0.356: SW1.3 28.03,25.32 28.03,26.41 v28.43,26.81
  Bottom 0.203: LDO1.3 25.25,28.47 | 25.25,28.47 25.25,27.9 25.51,27.64 27.12,27.64 27.15,27.61 | R2.2 23.98,34.48 v23.96,34.47 | v22.87,28.55 22.95,28.47 25.25,28.47
  Bottom 0.356: U2.4 30.43,32.66 C6.1 30.43,30.56 30.62,30.37 30.62,28.02 30.31,27.72 | v28.43,26.81 28.42,26.8 27.18,26.8 | 27.18,26.8 C7.1 | 27.18,26.8 27.15,26.82 27.15,27.61 LDO1.1
  Bottom 0.406: 30.31,27.72 29.34,27.72 28.42,26.8
VLIPO  (via drill 0.33)
  Top 0.356: J1.2 31.94,30.89 v32.19,30.85
  Bottom 0.356: D1.+ 32.19,30.63 v32.19,30.85 32.41,31.07 32.41,34.96 32.11,35.27 C9.1 U2.3

### Text on the board
tPlace: Cut-out | GERI Gadget | OFF | Cut-out